# Altium schematic sheet Frequency To Voltage Converter.schdoc: Frequency to Voltage Converter
size A4; Organization: Altium Limited; Address1: L3, 12a Rodborough Rd; Address2: Frenchs Forest; Address3: NSW; Address4: Australia 2086; DocumentNumber: 1; SheetNumber: 1; SheetTotal: 1
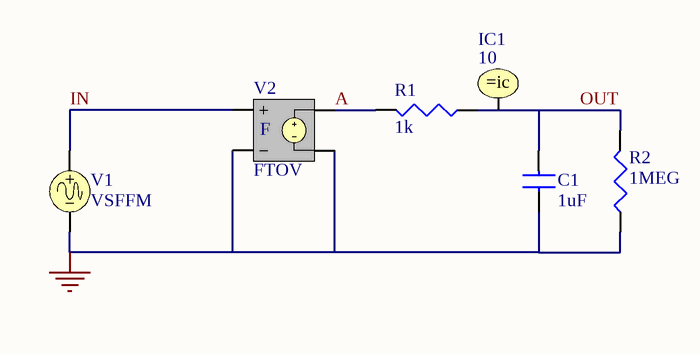
[diagram p0: Frequency To Voltage Converter.schdoc]

## Parts
C1  1uF
IC1  10
R1  1k
R2  1MEG
V1  VSFFM
V2  FTOV

## Nets
GND: C1.2 R2.2(BOT) V1.2 V2.2(NC-) V2.4(N-)
A: R1.1(TOP) V2.3(N+)
IN: V1.1 V2.1(NC+)
OUT: C1.1 IC1.1 R1.2(BOT) R2.1(TOP)

## Notes on the sheet
- Title
- Size:
- Date:
- A4
- Number:
- Time:
- Revision:
- Sheet
- of
- File:
- (in symbol FTOV) F

## Library data of the parts
C1 = CAP: Capacitor; Value: 1uF
IC1 = .IC: Initial Condition; Initial Voltage: 10
R1 R2 = RES: Resistor
  R1: Value: 1k
  R2: Value: 1MEG
V1 = VSFFM: Frequency-Modulated Sinusoidal Voltage Source
V2 = FTOV: Frequency to Voltage Converter